# EAGLE design board2 (EAGLE 8.7.1)
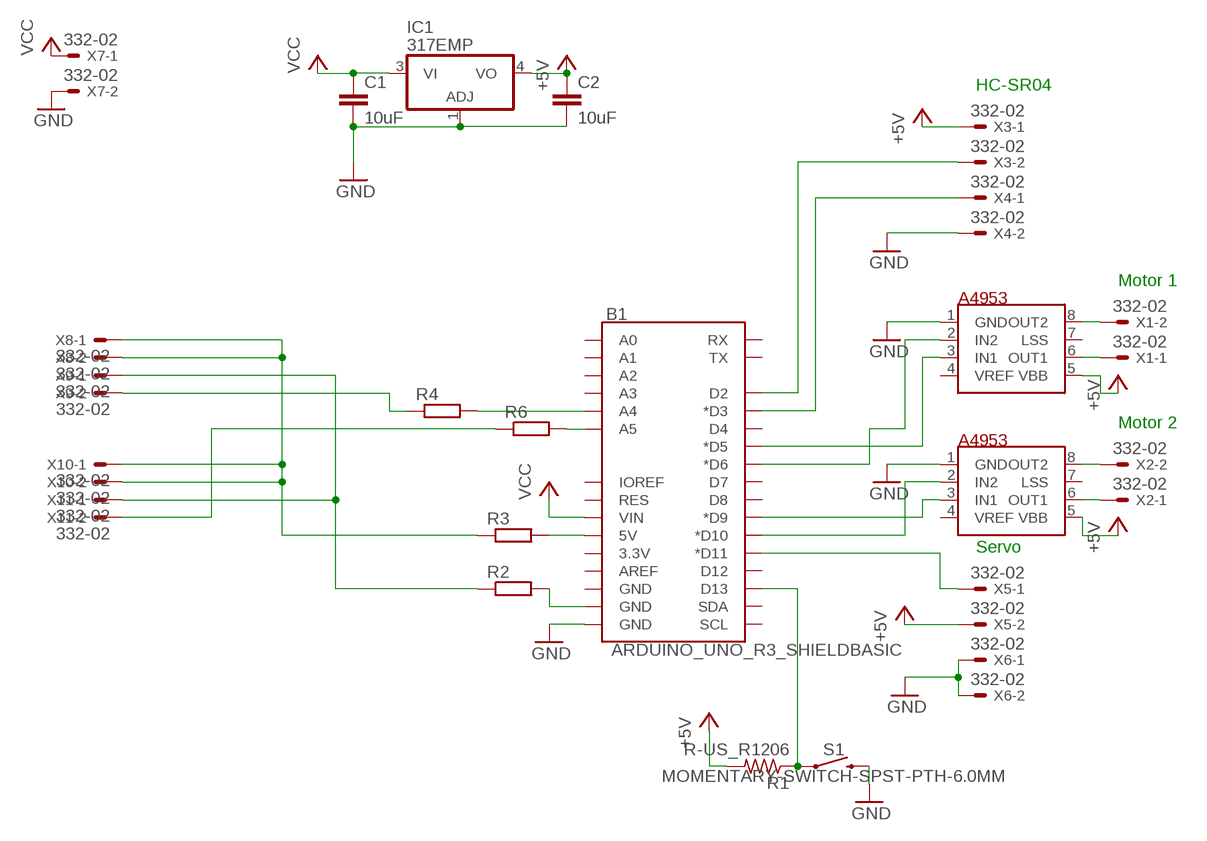
[diagram p0: schematic, sheet 1]

## Parts
A1  A4953  [SO08]
A2  A4953  [SO08]
B1  ARDUINO_UNO_R3_SHIELDBASIC  [UNO_R3_SHIELD]
C1  10uF  10UF-1206-6.3V-20%  [1206]
C2  10uF  10UF-1206-6.3V-20%  [1206]
IC1  317EMP  [SOT223]
R1  R-US_R1206  [R1206]
R2  RR1206  [R1206]
R3  RR1206  [R1206]
R4  RR1206  [R1206]
R6  RR1206  [R1206]
S1  MOMENTARY-SWITCH-SPST-PTH-6.0MM  [TACTILE_SWITCH_PTH_6.0MM]
X1  332-02  [332-02]
X2  332-02  [332-02]
X3  332-02  [332-02]
X4  332-02  [332-02]
X5  332-02  [332-02]
X6  332-02  [332-02]
X7  332-02  [332-02]
X8  332-02  [332-02]
X9  332-02  [332-02]
X10  332-02  [332-02]
X11  332-02  [332-02]

## Nets
+5V: A1.5(VBB) A2.5(VBB) C2.1 IC1.4(VO) R1.2 X3.1 X5.2
GND: A1.1(GND) A2.1(GND) B1.GND@0(GND) C1.2 C2.2 IC1.1(ADJ) S1.3 X4.2 X6.1 X6.2 X7.2
N$1: A1.3(IN1) B1.D5(*D5)
N$2: A1.2(IN2) B1.D6(*D6)
N$3: A2.3(IN1) B1.D9(*D9)
N$4: A2.2(IN2) B1.D10(*D10)
N$5: A1.6(OUT1) X1.1
N$6: A1.8(OUT2) X1.2
N$7: A2.6(OUT1) X2.1
N$8: A2.8(OUT2) X2.2
N$9: B1.D3(*D3) X4.1
N$10: B1.D2 X3.2
N$11: B1.D11(*D11) X5.1
N$12: B1.D13 R1.1 S1.1
N$13: B1.A4 R4.2
N$14: R3.1 X8.1 X8.2 X10.1 X10.2
N$15: R2.1 X9.1 X11.1
N$16: B1.GND@1(GND) R2.2
N$17: R4.1 X9.2
N$18: B1.5V R3.2
N$19: B1.A5 R6.2
N$20: R6.1 X11.2
VCC: B1.VIN C1.1 IC1.3(VI) X7.1
Unconnected: A1.4(VREF) A1.7(LSS) A2.4(VREF) A2.7(LSS) B1.3.3V B1.A0 B1.A1 B1.A2 B1.A3 B1.AREF B1.D4 B1.D7 B1.D8 B1.D12 B1.GND@2(GND) B1.IOREF B1.RES B1.RX B1.SCL B1.SDA B1.TX

## Notes on the sheet
- HC-SR04
- Motor 1
- Motor 2
- Servo

## Library data of the parts
A1 A2 = SparkFun-IC-Power:A4953: A4953 Full-Bridge DMOS PWM Motor Drivers
B1 = SparkFun-Boards:ARDUINO_UNO_R3_SHIELD: Arduino R3 Shield Footprint Shield form compatible with the Arduino Uno R3. SparkFun Products: MG2639 Cellular Shield <https://www.sparkfun.com/products/13120> MIDI Shield <https://www.sparkfun.com/products/12898> R3 Stackable Headers Kit <https://www.sparkfun.com/products/11417>
C1 C2 = SparkFun-Capacitors:10UF: 10.0µF ceramic capacitors A capacitor is a passive two-terminal electrical component used to store electrical energy temporarily in an electric field.; PROD_ID: CAP-10057
IC1 = linear:*317: Positive VOLTAGE REGULATOR
R1 = audio amplifier example:R-US_: RESISTOR, American symbol
R2-R4 R6 = eagle-ltspice:R: RESISTOR, European symbol; SPICEMODEL: NONE; SPICEPREFIX: R
S1 = SparkFun-Switches:MOMENTARY-SWITCH-SPST: Momentary Switch (Pushbutton) - SPST Normally-open (NO) SPST momentary switches (buttons, pushbuttons). Variants PTH-12MM - 12mm square, through-hole Momentary Pushbutton Switch - 12mm Square <https://www.sparkfun.com/products/9190> (COM-09190) PTH-6.0MM, PTH-6.0MM-KIT - 6.0mm square, through-hole Mini Pushbutton Switch <https://www.sparkfun.com/products/97> (COM-00097) KIT package intended for soldering kit's - only one side of pads' copper is exposed. PTH-RIGHT-ANGLE-KIT - Right-angle, through-hole Right Angle Tactile Button <https://www.sparkfun.com/products/10791> - Used on SparkFun BigTime Watch Kit <https://www.sparkfun.com/products/11734> SMD-12MM - 12mm square, surface-mount Tactile Button - SMD (12mm) <https://www.sparkfun.com/products/12993> (COM-12993) Used on SparkFun PicoBoard <https://www.sparkfun.com/products/11888> SMD-4.5MM - 4.5mm Square Trackball Switch Used on SparkFun Blackberry Trackballer Breakout <https://www.sparkfun.com/products/13169> SMD-4.6MMX2.8MM - 4.60mm x 2.80mm, surface mount Used on SparkFun SAMD21 Mini Breakout <https://www.sparkfun.com/products/13664> SMD-5.2MM, SMD-5.2-REDUNDANT - 5.2mm square, surface-mount Mini Pushbutton Switch - SMD <https://www.sparkfun.com/products/8720> (COM-08720) Used on Arduino Pro Mini <https://www.sparkfun.com/products/11114> REDUNDANT package connects both switch circuits together SMD-6.0X3.5MM - 6.0 x 3.5mm, surface mount Momentary Reset Switch SMD <https://www.sparkfun.com/products/8229> (COM-08229) SMD-6.2MM-TALL - 6.2mm square, surface mount Tactile Button - SMD (6mm) <https://www.sparkfun.com/products/12992> Used on SparkFun Digital Sandbox <https://www.sparkfun.com/products/12651> SMD-RIGHT-ANGLE - Right-angle, surface mount Used on SparkFun Block for Intel® Edison - Arduino <https://www.sparkfun.com/products/13036>; PROD_ID: SWCH-08441; SF_SKU: COM-00097
X1-X11 = con-garry:332-02: 2 Pin - 2mm Dual Row Source: www.mpe-connector.de / garry_shortform_2012.pdf

## Board
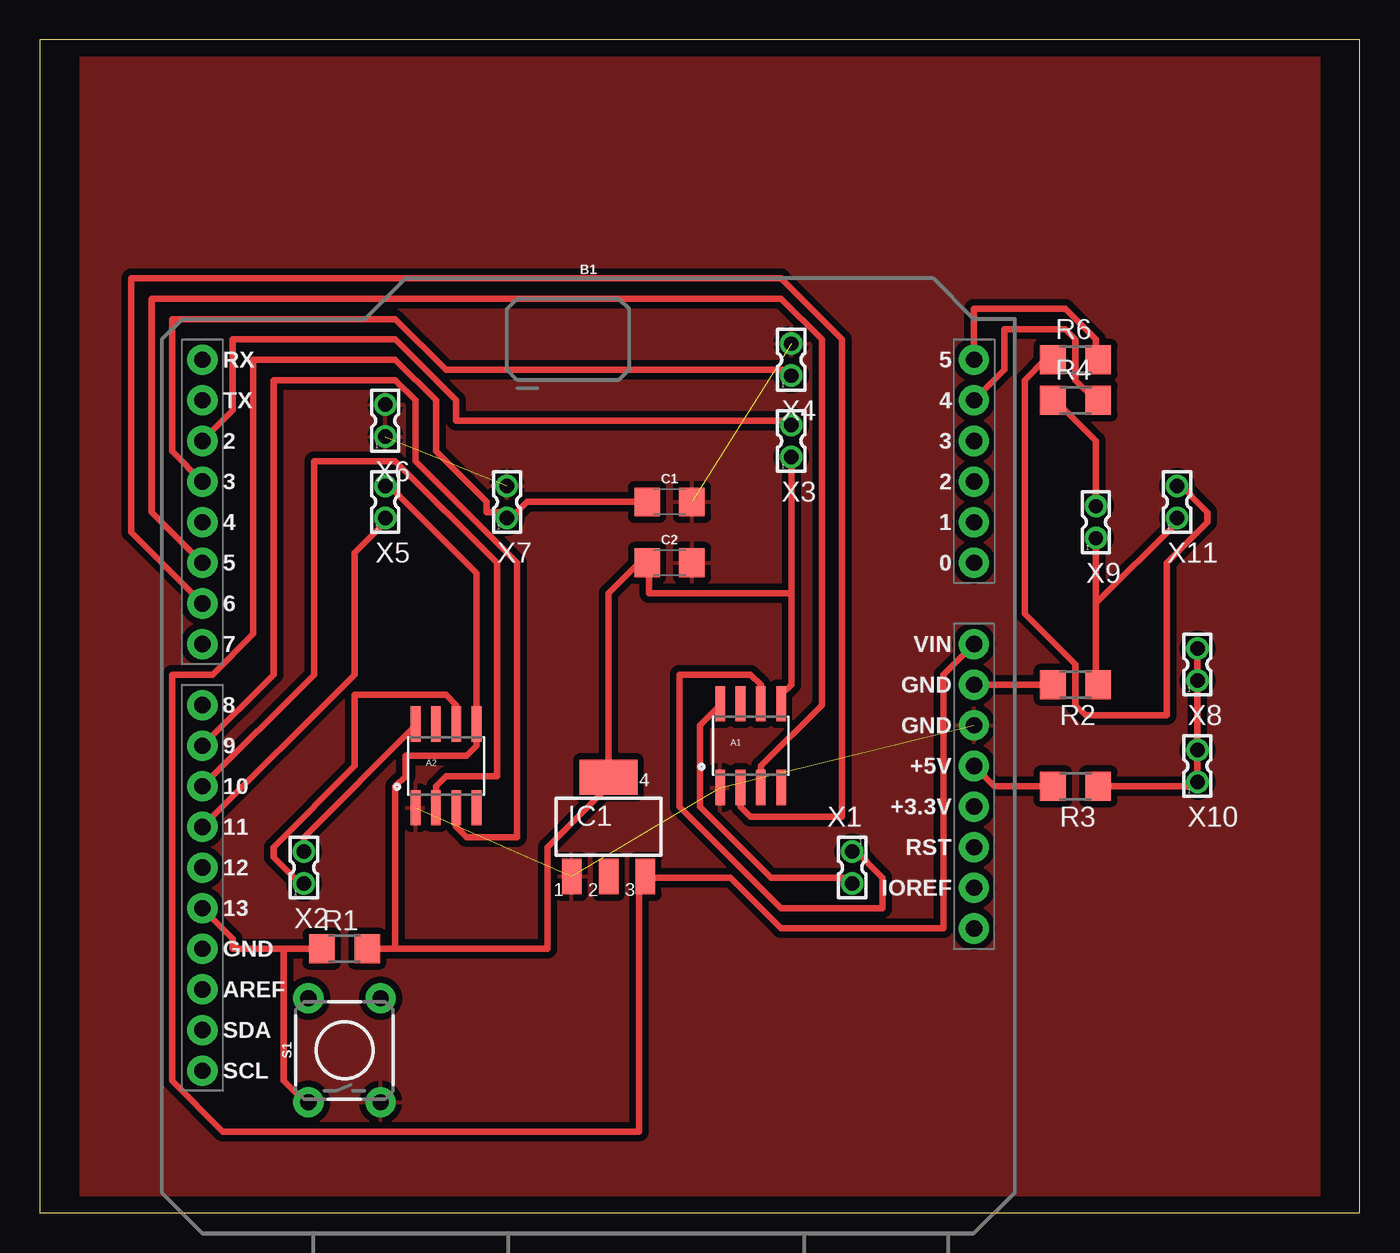
[diagram p1: board, top side]

Size 82.53 x 73.33 mm. Coordinates in mm from the lower left corner, seen from the top.
Outline: 0,0 82.53,0 82.53,73.33 0,73.33 0,0
Copper layers (1*16): Top 0.035mm / dielectric 1.5mm / Bottom 0.035mm
Design rules "default *": minimum track width 16mil, minimum drill 0.35mm, track to track 16mil, track to pad 16mil, pad to pad 16mil, via to via 16mil, smd to smd 16mil, copper to edge 40mil, drill to drill 6mil, minimum pad ring 10mil, minimum via ring 8mil, stop-mask expansion 4mil, vias tented up to drill 0mil, thermal gap 16mil

### Footprints (pad centres in the part's own frame; a part is rotated, then mirrored left to right if it is on the bottom)
SO08 = smd 0.61 x 2.21: 1 -1.905,-2.616; 2 -0.635,-2.616; 3 0.635,-2.616; 4 1.905,-2.616; 5 1.905,2.616; 6 0.635,2.616; 7 -0.635,2.616; 8 -1.905,2.616
UNO_R3_SHIELD = drill 1.016 pad 1.88: 3.3V 24.13,-2.54; 5V 24.13,0; A0 24.13,12.7; A1 24.13,15.24; A2 24.13,17.78; A3 24.13,20.32; A4 24.13,22.86; A5 24.13,25.4; AREF -24.13,-13.97; D2 -24.13,20.32; D3 -24.13,17.78; D4 -24.13,15.24; D5 -24.13,12.7; D6 -24.13,10.16; D7 -24.13,7.62; D8 -24.13,3.81; D9 -24.13,1.27; D10 -24.13,-1.27; D11 -24.13,-3.81; D12 -24.13,-6.35; D13 -24.13,-8.89; GND@0 24.13,2.54; GND@1 24.13,5.08; GND@2 -24.13,-11.43; IOREF 24.13,-7.62; NC 24.13,-10.16; RES 24.13,-5.08; RX -24.13,25.4; SCL -24.13,-19.05; SDA -24.13,-16.51; TX -24.13,22.86; VIN 24.13,7.62
1206 = smd 1.6 x 1.8: 1 -1.4,0; 2 1.4,0
SOT223 = smd 1.219 x 2.235: 1 -2.311,-3.099; 2 0,-3.099; 3 2.311,-3.099 | smd 3.6 x 2.2: 4 0,3.099
R1206 = smd 1.6 x 1.803: 1 -1.422,0; 2 1.422,0
TACTILE_SWITCH_PTH_6.0MM = drill 1.016 pad 1.88: 1 -3.251,2.261; 2 3.251,2.261; 3 -3.251,-2.261; 4 3.251,-2.261
332-02 = drill 0.9 pad 1.27: 1 0,-1; 2 0,1

### Placement (x,y rotation side)
A1  44.45,29.21 0 top
A2  25.4,27.94 0 top
B1  34.29,27.94 0 top
C1  39.37,44.45 0 top
C2  39.37,40.64 0 top
IC1  35.56,24.13 0 top
R1  19.05,16.51 0 top
R2  64.77,33.02 180 top
R3  64.77,26.67 180 top
R4  64.77,50.8 0 top
R6  64.77,53.34 0 top
S1  19.05,10.16 90 top
X1  50.8,21.59 180 top
X2  16.51,21.59 0 top
X3  46.99,48.26 0 top
X4  46.99,53.34 0 top
X5  21.59,44.45 0 top
X6  21.59,49.53 0 top
X7  29.21,44.45 0 top
X8  72.39,34.29 0 top
X9  66.04,43.18 0 top
X10  72.39,27.94 0 top
X11  71.12,44.45 0 top

### Tracks (layer width: path | path; a pad name or v marks a point on that pad's centre or on a via)
+5V
  Top 0.406: X5.2 21.59,45.72 27.31,40 A2.5 27.31,29.21 26.67,28.57 22.86,28.57 22.86,27.3 22.23,26.67 22.23,16.51 | X3.1 46.99,38.73 | 46.99,38.73 46.99,33.02 46.36,32.38 A1.5 | 22.23,16.51 31.75,16.51 31.75,22.86 35.56,26.67 IC1.4 35.56,38.73 37.47,40.64 C2.1 38.1,40.64 38.1,38.73 46.99,38.73 | 22.23,16.51 R1.2
GND  (5 unrouted)
  pour Top: 2.54,72.39 80.01,72.39 80.01,-1.27 2.54,-1.27
N$1
  Top 0.406: A1.3 45.09,27.94 48.9,31.75 48.9,54.61 46.36,57.15 6.99,57.15 6.99,43.81 B1.D5
N$2
  Top 0.406: A1.2 43.82,25.4 44.45,24.77 50.17,24.77 50.17,54.61 46.36,58.42 5.72,58.42 5.72,42.55 B1.D6
N$3
  Top 0.406: A2.3 26.04,24.13 26.67,23.49 29.85,23.49 29.85,40.64 23.5,46.99 23.5,50.8 22.23,52.07 14.61,52.07 14.61,33.66 B1.D9
N$4
  Top 0.406: A2.2 24.77,26.67 25.4,27.3 28.58,27.3 28.58,40.64 22.23,46.99 17.15,46.99 17.15,33.66 B1.D10
N$5
  Top 0.406: A1.6 45.09,33.02 44.45,33.66 40.01,33.66 40.01,25.4 46.36,19.05 52.71,19.05 52.71,20.95 50.8,22.86 X1.1
N$6
  Top 0.406: A1.8 42.55,31.75 41.28,30.48 41.28,25.4 45.72,20.95 50.8,20.95 X1.2
N$7
  Top 0.406: A2.6 26.04,31.75 25.4,32.38 19.69,32.38 19.69,27.94 14.61,22.86 14.61,22.23 16.51,20.32 X2.1
N$8
  Top 0.406: X2.2 16.51,23.49 23.5,30.48 A2.8
N$9
  Top 0.406: B1.D3 8.26,47.62 8.26,55.88 22.23,55.88 25.4,52.7 46.99,52.7 X4.1
N$10
  Top 0.406: B1.D2 12.07,50.16 12.07,54.61 22.23,54.61 26.04,50.8 26.04,49.53 46.99,49.53 X3.2
N$11
  Top 0.406: B1.D11 19.69,33.66 19.69,41.27 21.59,43.18 X5.1
N$12
  Top 0.406: 15.24,16.51 12.07,16.51 12.07,17.14 B1.D13 | 15.24,16.51 R1.1 | 15.24,16.51 15.24,8.25 16.51,6.98 S1.1
N$13
  Top 0.406: B1.A4 60.33,52.7 60.33,55.25 64.14,55.25 64.77,54.61 64.77,52.07 66.04,50.8 R4.2
N$14
  Top 0.406: X8.2 X8.1 X10.2 X10.1 72.39,26.67 R3.1
N$15
  Top 0.406: X9.1 66.04,38.1 | 66.04,38.1 66.04,33.02 R2.1 | 66.04,38.1 71.12,43.18 X11.1
N$16
  Top 0.406: B1.GND@1 R2.2
N$17
  Top 0.406: X9.2 66.04,48.26 63.5,50.8 R4.1
N$18
  Top 0.406: R3.2 59.69,26.67 B1.5V
N$19
  Top 0.406: B1.A5 58.42,56.52 64.14,56.52 66.04,54.61 66.04,53.34 R6.2
N$20
  Top 0.406: R6.1 62.87,53.34 61.6,52.07 61.6,37.46 64.77,34.29 64.77,31.75 65.41,31.12 70.49,31.12 70.49,40.64 73.03,43.18 73.03,43.81 71.12,45.72 X11.2
VCC
  Top 0.406: C1.1 30.48,44.45 29.21,43.18 X7.1 29.21,43.81 27.94,43.81 27.94,44.45 24.77,47.62 24.77,50.8 22.23,53.34 13.34,53.34 13.34,36.2 10.8,33.66 8.26,33.66 8.26,8.25 11.43,5.08 37.47,5.08 37.47,20.95 IC1.3 38.1,20.95 43.18,20.95 46.36,17.78 56.52,17.78 56.52,33.66 B1.VIN